# Altium schematic sheet Шаблон А0 В Лист_2.SchDoc: Название изделия
size 840 x 1188 mm; ApprovedBy: Утвердил; CheckedBy: Проверил; Author: Разработал; CompanyName: Организация; Engineer: Нормоконтроль; DocumentNumber: Децимальный номер; SheetNumber: 1; SheetTotal: 1; Lit_1: У; Technologist: Технолог
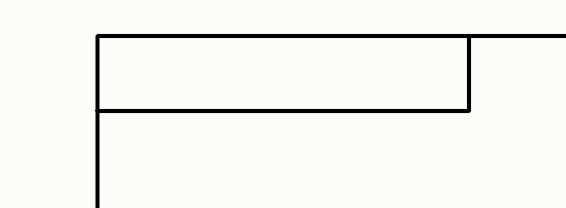
[diagram p0: Шаблон А0 В Лист_2.SchDoc, row 1 of 4 left]
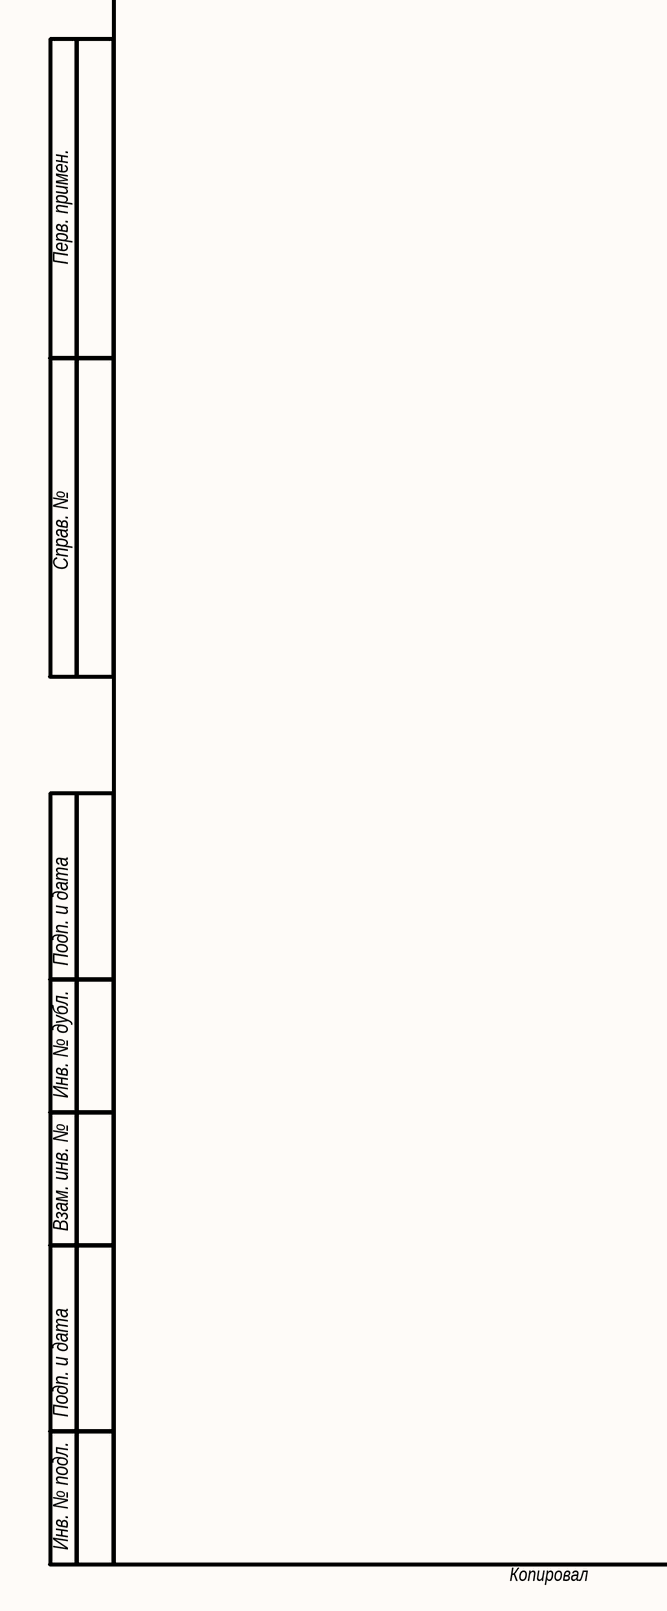
[diagram p1: Шаблон А0 В Лист_2.SchDoc, row 4 of 4 left]
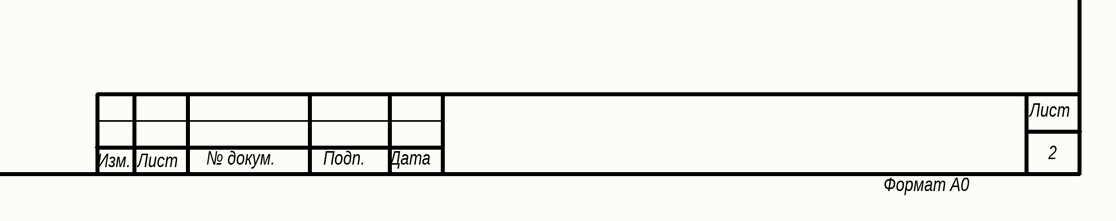
[diagram p2: Шаблон А0 В Лист_2.SchDoc, row 4 of 4 right]

## Notes on the sheet
- Перв. примен.
- Справ. №
- Подп. и дата
- Инв. № дубл.
- Взам. инв. №
- Инв. № подл.
- Изм.
- Лист
- № докум.
- Подп.
- Дата
- 2
- Копировал
- Формат А0